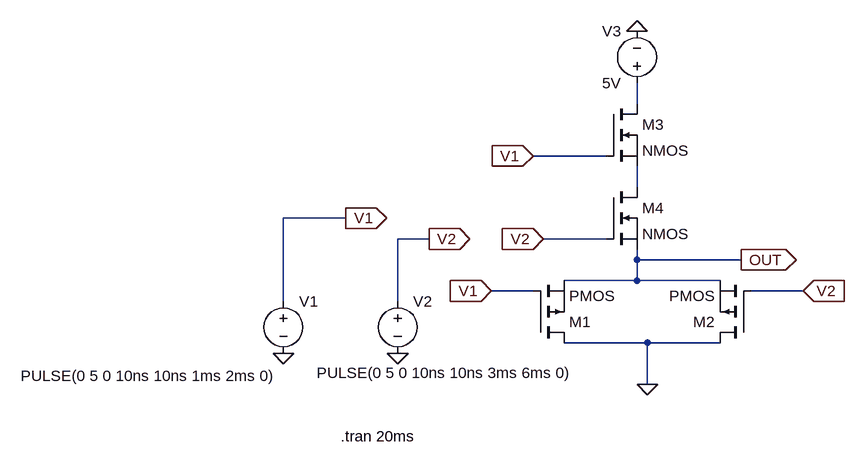
[diagram p0: schematic PorteAND.asc]
PorteAND.asc, the LTspice schematic file:
Version 4
SHEET 1 880 680
WIRE 336 0 336 -32
WIRE 288 80 176 80
WIRE 336 128 336 96
WIRE -112 176 -208 176
WIRE 16 208 -32 208
WIRE 288 208 192 208
WIRE 336 240 336 224
WIRE 496 240 336 240
WIRE 336 272 336 240
WIRE 336 272 224 272
WIRE 464 272 336 272
WIRE 176 288 112 288
WIRE 592 288 512 288
WIRE -208 304 -208 176
WIRE -32 304 -32 208
WIRE 352 368 224 368
WIRE 464 368 352 368
WIRE 352 432 352 368
FLAG 336 -112 0
FLAG -112 176 V1
IOPIN -112 176 Out
FLAG 112 288 V1
IOPIN 112 288 In
FLAG 176 80 V1
IOPIN 176 80 In
FLAG 496 240 OUT
IOPIN 496 240 Out
FLAG 16 208 V2
IOPIN 16 208 Out
FLAG 192 208 V2
IOPIN 192 208 In
FLAG 592 288 V2
IOPIN 592 288 In
FLAG 352 432 0
FLAG -32 384 0
FLAG -208 384 0
SYMBOL voltage -208 288 R0
WINDOW 3 -404 131 Left 2
WINDOW 123 0 0 Left 0
WINDOW 39 0 0 Left 0
SYMATTR Value PULSE(0 5 0 10ns 10ns 1ms 2ms 0)
SYMATTR InstName V1
SYMBOL voltage -32 288 R0
WINDOW 3 -125 126 Left 2
WINDOW 123 0 0 Left 0
WINDOW 39 0 0 Left 0
SYMATTR Value PULSE(0 5 0 10ns 10ns 3ms 6ms 0)
SYMATTR InstName V2
SYMBOL voltage 336 -16 R180
WINDOW 0 24 96 Left 2
WINDOW 3 24 16 Left 2
WINDOW 123 0 0 Left 0
WINDOW 39 0 0 Left 0
SYMATTR InstName V3
SYMATTR Value 5V
SYMBOL pmos 176 368 M180
SYMATTR InstName M1
SYMBOL pmos 512 368 R180
SYMATTR InstName M2
SYMBOL nmos 288 0 R0
SYMATTR InstName M3
SYMBOL nmos 288 128 R0
SYMATTR InstName M4
TEXT -120 512 Left 2 !.tran 20ms

The netlist it stands for:
* PorteAND.asc
V1 V1 0 PULSE(0 5 0 10ns 10ns 1ms 2ms 0)
V2 V2 0 PULSE(0 5 0 10ns 10ns 3ms 6ms 0)
V3 N001 0 5V
M1 0 V1 OUT OUT PMOS
M2 0 V2 OUT OUT PMOS
M3 N001 V1 N002 N002 NMOS
M4 N002 V2 OUT OUT NMOS
.model NMOS NMOS
.model PMOS PMOS
.lib standard.mos
.tran 20ms
.backanno
.end

* Results of the author's LTspice run, read from the files saved beside the schematic
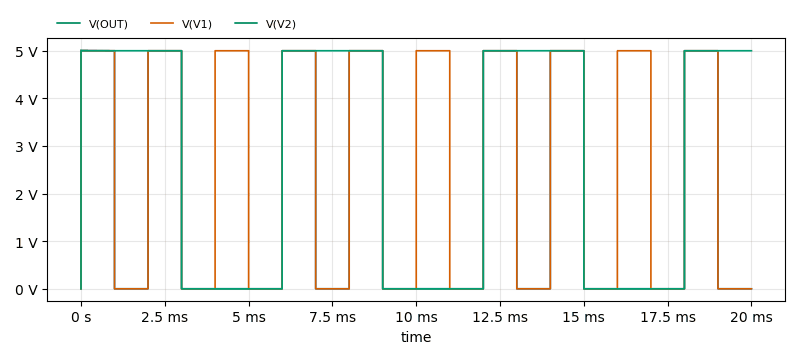
[diagram p1: Transient Analysis of PorteAND.asc, plotted from the saved traces]
* Transient Analysis, 1 run:
*   V(OUT): min 500.4 µV, max 5.008 V, average 1.75 V, rms 2.957 V, last 1 mV
*   V(V1): min 0 V, max 5 V, average 2.5 V, rms 3.536 V, last 0 V
*   V(V2): min 0 V, max 5 V, average 2.75 V, rms 3.708 V, last 5 V